# EAGLE design 2021-04-16 BOSS-RoboClaw-Breakout (EAGLE 9.6.2)
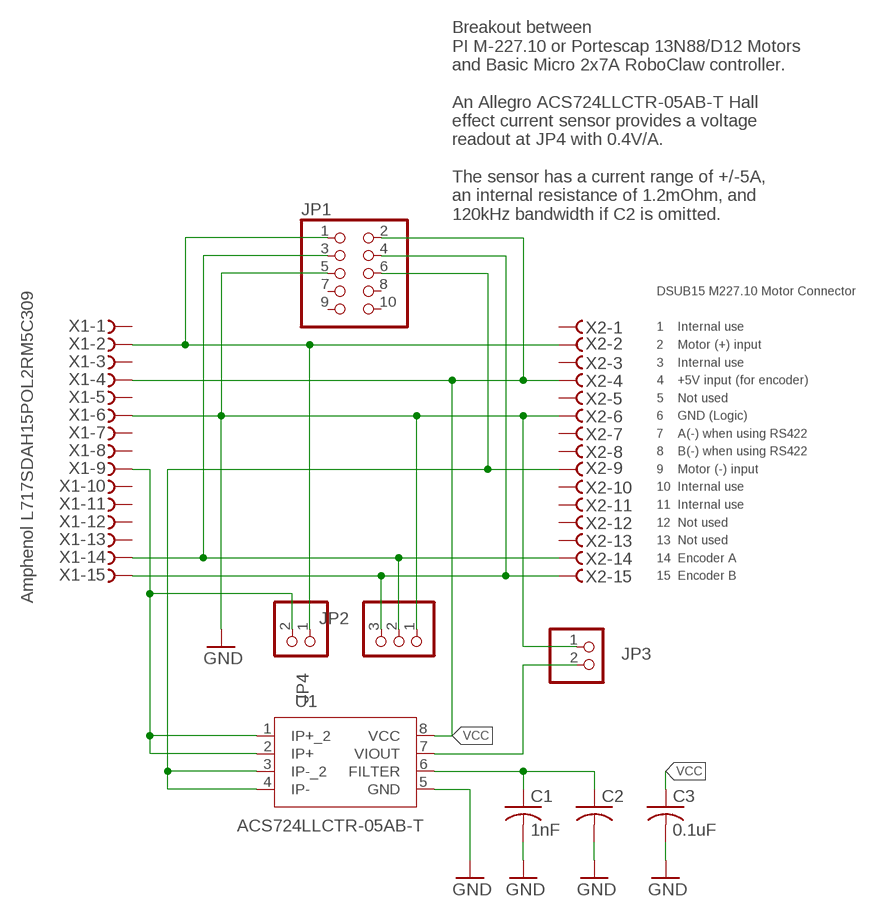
[diagram p0: schematic, sheet 1]

## Parts
C1  1nF  C-USC0805  [C0805]
C2  C-USC0805  [C0805]
C3  0.1uF  C-USC0805  [C0805]
JP1  PINHD-2X5  [2X05]
JP2  PINHD-1X3  [1X03]
JP3  PINHD-1X2  [1X02]
JP4  PINHD-1X2  [1X02]
U1  ACS724LLCTR-05AB-T  CURRENTSENSOR-ACS724LLCTR-05AB-T  [IC8_ACS724LLCTR-05AB-T_ALM]
X1  Amphenol L717SDAH15POL2RM5C309  D-SUB15-H2M15ST  [H2M15ST]
X2  Amphenol L77SDAH15SOL2RM8C309  D-SUB15-H2R15ST  [H2R15ST]

## Nets
ENCA: JP1.3 JP2.2 X1.14 X2.14
ENCB: JP1.4 JP2.3 X1.15 X2.15
FILTER: C1.1 C2.1 U1.6(FILTER)
GND: C1.2 C2.2 C3.2 JP1.5 JP2.1 JP3.1 U1.5(GND) X1.6 X2.6
M+: JP1.1 JP4.1 X1.2 X2.2
M-: JP1.6 U1.3(IP-_2) U1.4(IP-) X2.9
N$5: JP4.2 U1.1(IP+_2) U1.2(IP+) X1.9
VCC: C3.1 JP1.2 U1.8(VCC) X1.4 X2.4
VIOUT: JP3.2 U1.7(VIOUT)
Unconnected: JP1.7 JP1.8 JP1.9 JP1.10 X1.1 X1.3 X1.5 X1.7 X1.8 X1.10 X1.11 X1.12 X1.13 X2.1 X2.3 X2.5 X2.7 X2.8 X2.10 X2.11 X2.12 X2.13

## Notes on the sheet
- Breakout between
  PI M-227.10 or Portescap 13N88/D12 Motors
  and Basic Micro 2x7A RoboClaw controller.
  
  An Allegro ACS724LLCTR-05AB-T Hall
  effect current sensor provides a voltage
  readout at JP4 with 0.4V/A.
  
  The sensor has a current range of +/-5A,
  an internal resistance of 1.2mOhm, and
  120kHz bandwidth if C2 is omitted.
- DSUB15 M227.10 Motor Connector
  
  1    Internal use
  2    Motor (+) input
  3    Internal use
  4    +5V input (for encoder)
  5    Not used
  6    GND (Logic)
  7    A(-) when using RS422
  8    B(-) when using RS422
  9    Motor (-) input
  10  Internal use
  11  Internal use
  12  Not used
  13  Not used
  14  Encoder A
  15  Encoder B

## Library data of the parts
C1-C3 = AUmlib:C-US: CAPACITOR, American symbol; SPICEPREFIX: C
JP1 = AUmlib:PINHD-2X5: PIN HEADER
JP2 = AUmlib:PINHD-1X3: PIN HEADER
JP3 JP4 = AUmlib:PINHD-1X2: PIN HEADER
U1 = AUmlib:CURRENTSENSOR-ACS724LLCTR-05AB-T; BUILT_BY: EMA_Kyle; COPYRIGHT: Copyright (C) 2018 Accelerated Designs. All rights reserved; DATASHEET: https://www.digikey.com/product-detail/en/allegro-microsystems/ACS724LLCTR-05AB-T/620-ACS724LLCTR-05AB-TTR-ND/5400755; MANUFACTURER_PART_NUMBER: ACS724LLCTR-05AB-T; SOURCELIBRARY: Allegro_Microsystems_Inc_2020-07-30; VENDOR: Allegro Microsystems Inc.
X1 X2 = AUmlib:D-SUB15-: D-Subminiatur Connector Source: Electronioc Interconnects European Edition 1998; OC_FARNELL: unknown; OC_NEWARK: unknown

## Board
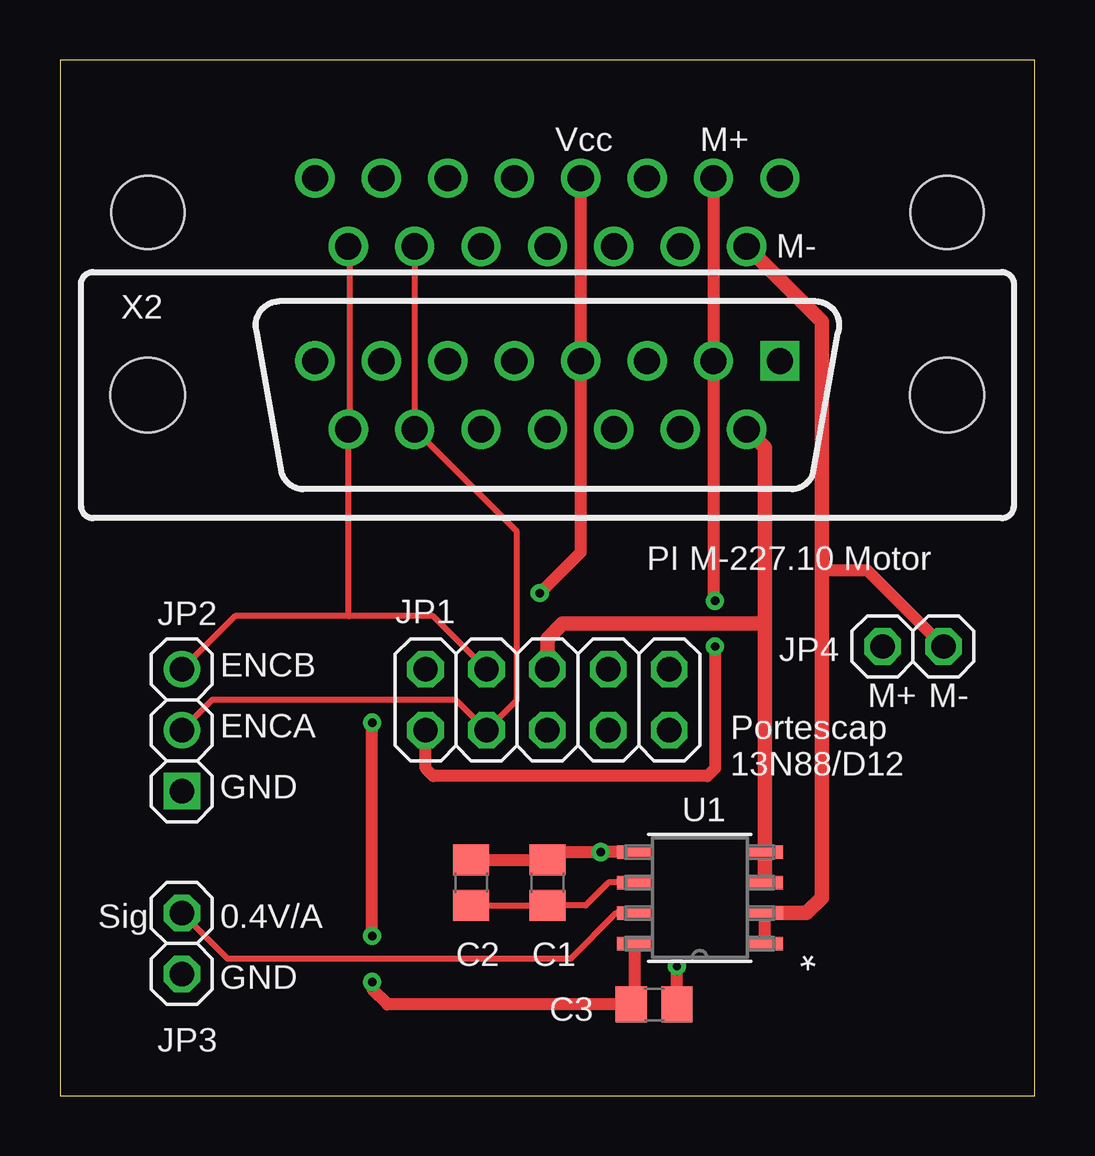
[diagram p1: board, top side]
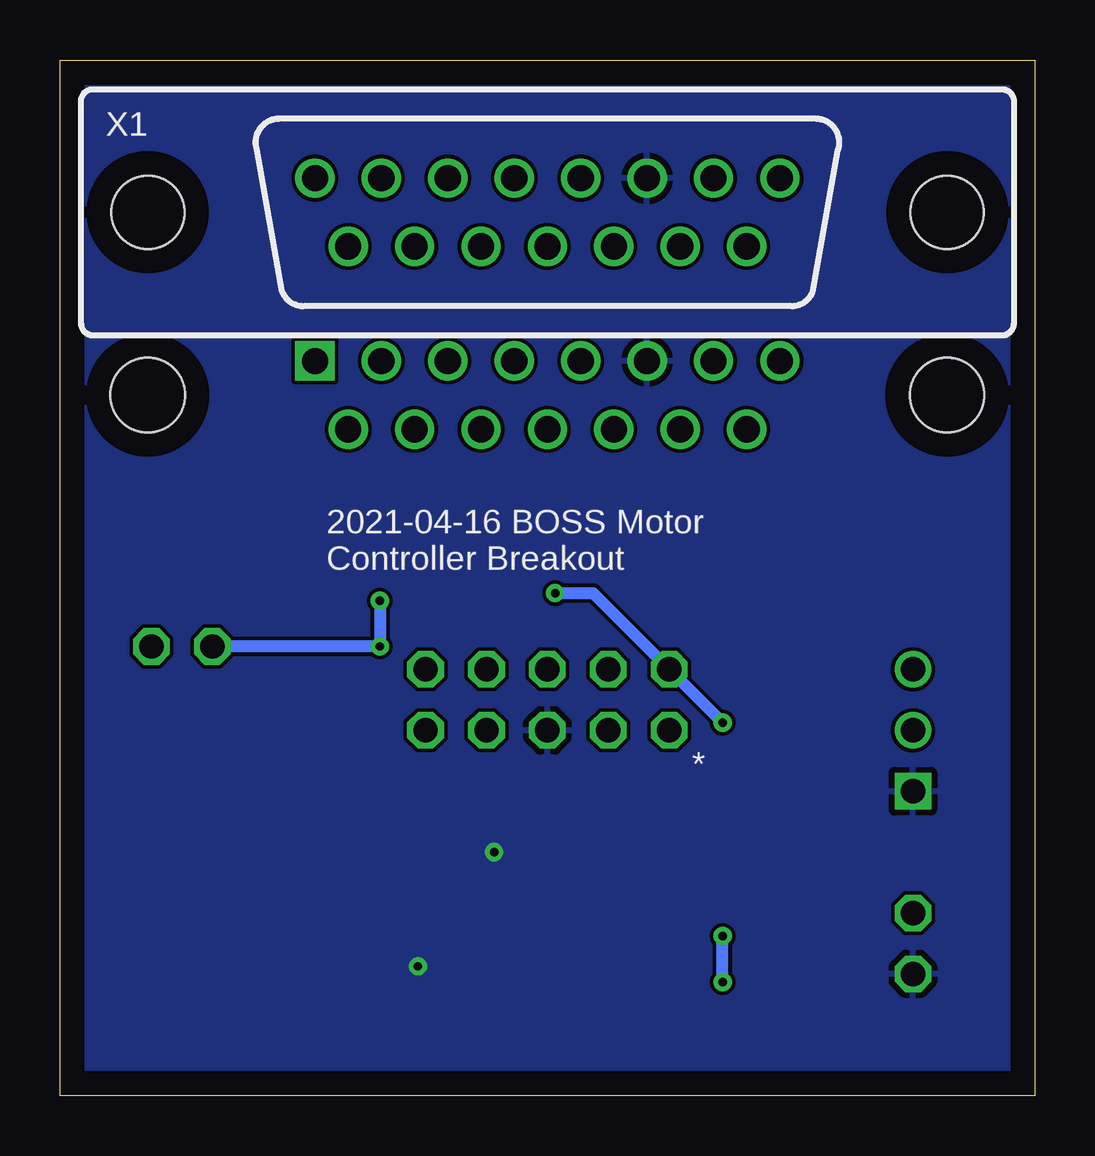
[diagram p2: board, bottom side, seen from below]

Size 40.64 x 43.18 mm. Coordinates in mm from the lower left corner, seen from the top.
Outline: 0,0 40.64,0 40.64,43.18 0,43.18 0,0
Copper layers (1*16): Top 0.035mm / dielectric 1.5mm / Bottom 0.035mm
Design rules "default": minimum track width 6mil, minimum drill 0.35mm, track to track 6mil, track to pad 6mil, pad to pad 6mil, via to via 6mil, smd to smd 6mil, copper to edge 40mil, drill to drill 6mil, minimum pad ring 10mil, minimum via ring 8mil, stop-mask expansion 4mil, vias tented up to drill 0mil, thermal gap 10mil

### Footprints (pad centres in the part's own frame; a part is rotated, then mirrored left to right if it is on the bottom)
C0805 = smd 1.3 x 1.5: 1 -0.95,0; 2 0.95,0
2X05 = drill 1.016 octagon: 1 -5.08,-1.27; 2 -5.08,1.27; 3 -2.54,-1.27; 4 -2.54,1.27; 5 0,-1.27; 6 0,1.27; 7 2.54,-1.27; 8 2.54,1.27; 9 5.08,-1.27; 10 5.08,1.27
1X03 = drill 1.016 square: 1 -2.54,0 | drill 1.016: 2 0,0; 3 2.54,0
1X02 = drill 1.016 octagon: 1 -1.27,0; 2 1.27,0
IC8_ACS724LLCTR-05AB-T_ALM = smd 1.462 x 0.559: 1 -2.725,1.905; 2 -2.725,0.635; 3 -2.725,-0.635; 4 -2.725,-1.905; 5 2.725,-1.905; 6 2.725,-0.635; 7 2.725,0.635; 8 2.725,1.905
H2M15ST = drill 1.092: 1 -9.69,1.422; 2 -6.921,1.422; 3 -4.153,1.422; 4 -1.384,1.422; 5 1.384,1.422; 6 4.153,1.422; 7 6.921,1.422; 8 9.69,1.422; 9 -8.306,-1.422; 10 -5.537,-1.422; 11 -2.769,-1.422; 12 0,-1.422; 13 2.769,-1.422; 14 5.537,-1.422; 15 8.306,-1.422 | hole 3.048: -16.662,0; 16.662,0
H2R15ST = drill 1.092 square: 1 9.69,1.422 | drill 1.092: 2 6.921,1.422; 3 4.153,1.422; 4 1.384,1.422; 5 -1.384,1.422; 6 -4.153,1.422; 7 -6.921,1.422; 8 -9.69,1.422; 9 8.306,-1.422; 10 5.537,-1.422; 11 2.769,-1.422; 12 0,-1.422; 13 -2.769,-1.422; 14 -5.537,-1.422; 15 -8.306,-1.422 | hole 3.1: -16.662,0; 16.662,0

### Placement (x,y rotation side)
C1  20.32,8.89 90 top
C2  17.14,8.89 90 top
C3  24.77,3.81 0 top
JP1  20.32,16.51 0 top
JP2  5.08,15.24 90 top
JP3  5.08,6.35 90 top
JP4  35.56,18.73 0 top
U1  26.67,8.26 180 top
X1  20.32,36.83 0 bottom
X2  20.32,29.21 0 top

### Tracks (layer width: path | path; a pad name or v marks a point on that pad's centre or on a via)
ENCA
  Top 0.254: JP2.2 6.35,16.51 16.51,16.51 JP1.3 19.05,16.51 19.05,23.52 X2.14 X1.14
ENCB
  Top 0.203: X2.15 12.06,27.74 | X1.15 12.06,35.36
  Top 0.254: 12.06,35.36 12.06,27.74 | JP1.4 15.56,20 12.06,20 | 12.06,20 7.3,20 JP2.3 | X2.15 12.01,20.05 12.06,20
FILTER
  Top 0.254: C2.1 C1.1 21.91,7.94 22.86,8.89 U1.6
GND  (via drill 0.35)
  Top 0.508: C2.2 C1.2 20.64,10.16 v22.54,10.16 U1.5 | C3.2 v25.72,5.4
  pour Bottom: 0,0 0,43.18 40.64,43.18 40.64,0
M+  (via drill 0.35)
  Top 0.508: X1.2 X2.2 27.24,20.7 v27.3,20.64 | v27.3,18.73 27.3,13.65 26.99,13.34 15.56,13.34 15.24,13.65 JP1.1
  Bottom 0.508: v27.3,20.64 v27.3,18.73 JP4.1
M-
  Top 0.61: U1.3 U1.4 29.39,19.68 | 29.39,19.68 29.39,27.02 X2.9 | JP1.6 20.32,19.05 20.95,19.68 29.39,19.68
N$5
  Top 0.508: U1.1 U1.2 | JP4.2 33.66,21.91 31.75,21.91
  Top 0.61: X1.9 31.75,32.28 31.75,21.91 31.75,8.26 31.11,7.62 U1.2
VCC  (via drill 0.35)
  Top 0.508: X1.4 X2.4 21.7,22.66 v20,20.95 | U1.8 23.95,3.94 C3.1 13.65,3.81 13.02,4.45 v13.02,4.74 | v13.02,6.67 v13.02,15.56
  Bottom 0.508: v20,20.95 18.41,20.95 JP1.2 v13.02,15.56 | v13.02,4.74 v13.02,6.67
VIOUT
  Top 0.254: U1.7 23.18,7.62 21.27,5.71 6.99,5.71 JP3.2

### Text on the board
tPlace: Vcc | M+ | M- | PI M-227.10 Motor | ENCB | M+ | M- | ENCA | Portescap / 13N88/D12 | GND | Sig | 0.4V/A | GND
bPlace: 2021-04-16 BOSS Motor / Controller Breakout | *